# Altium project TrailGuard2.0.PrjPcb
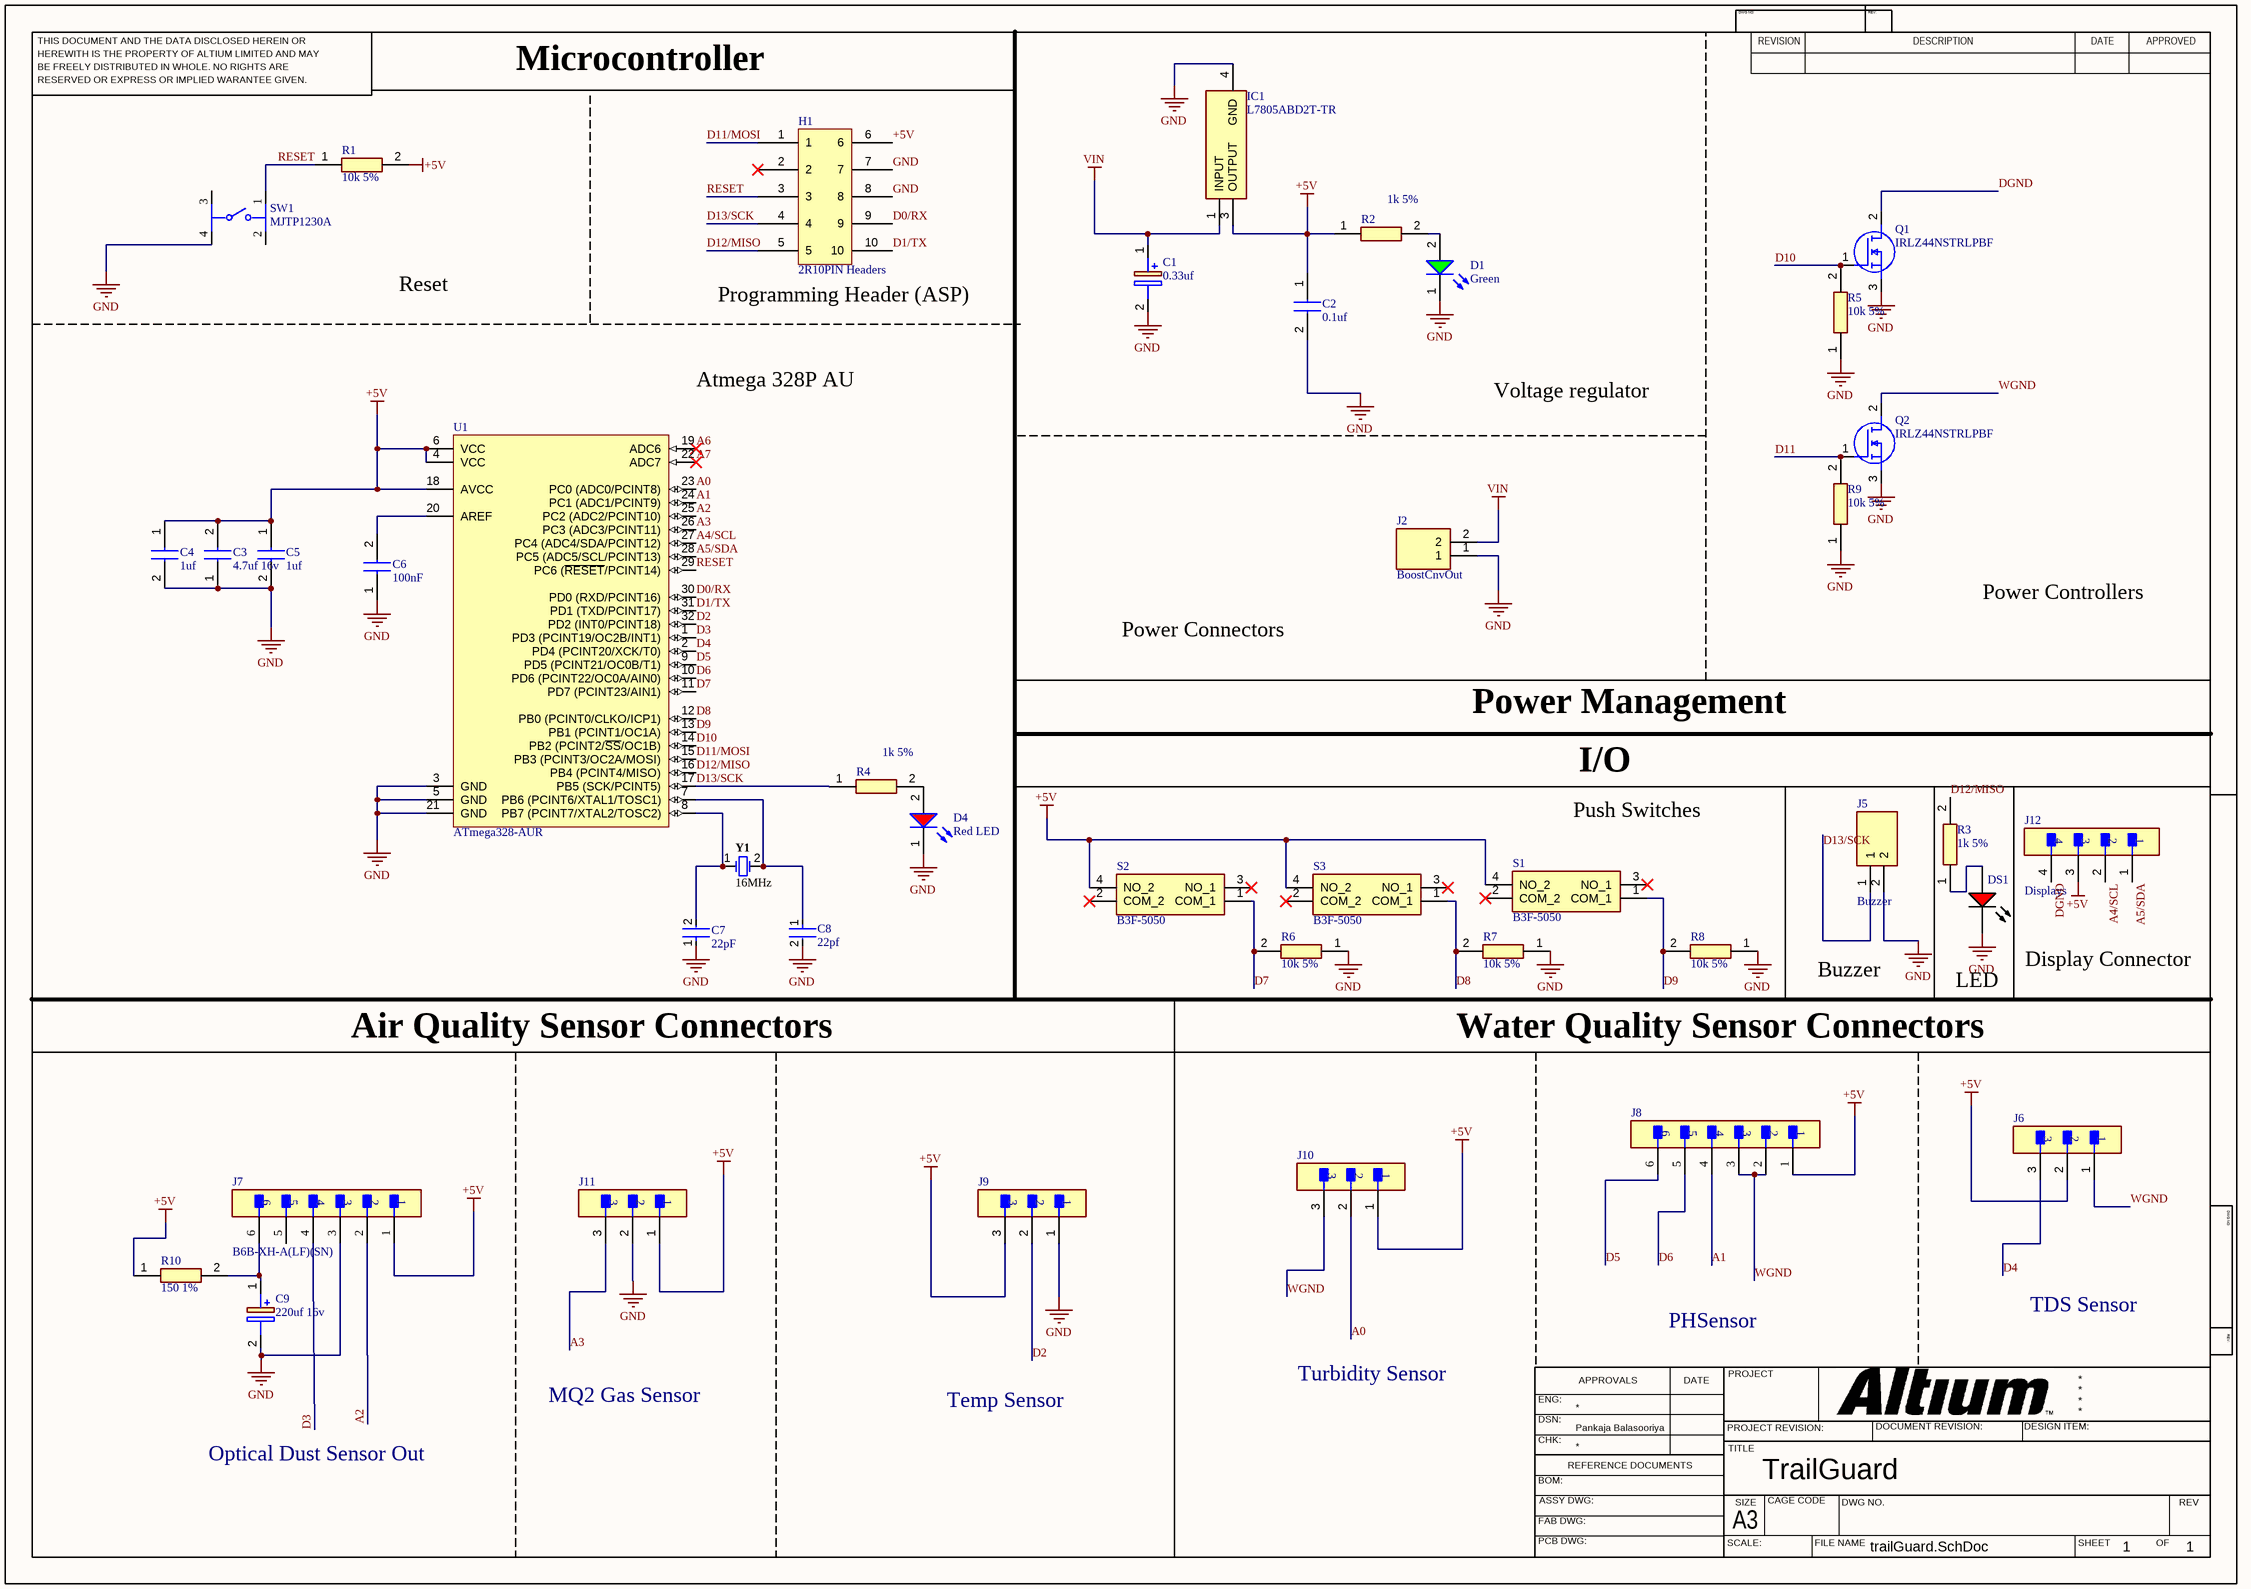
[diagram p0: trailGuard.SchDoc]
1 sheet, 41 parts. Net scope: global (net labels, ports and power ports of the same name join across sheets).
Board file: trailGuard.PcbDoc

## Sheet trailGuard.SchDoc: TrailGuard
size 420 x 297 mm; Author: Pankaja Balasooriya; DrawnBy: Pankaja Balasooriya; SheetNumber: 1; SheetTotal: 1

### Parts
C1  0.33uf  [CAPPM3216X180N]
C2  0.1uf  [C1206]
C3  4.7uf 16v  [CAPC3216X180N]
C4  1uf  [C1206]
C5  1uf  [C1206]
C6  100nF  [CAPC3216X190N]
C7  22pF  [FP-CL21-IPC_C]
C8  22pf  [FP-CL21-IPC_C]
C9  220uf 16v  [EEE0JA331XP]
D1  Green  [WL-SMCW_0805_150080xx75000]
D4  Red LED  [WL-SMCW_0805_150080xx75000]
DS1  HLMP-3301  [AVAG-HLMP-3301-2]  (value not drawn)
H1  2R10PIN Headers  [2R10PIN Headers]
IC1  L7805ABD2T-TR  [D2PAK-STB35NF10T4]
J2  BoostCnvOut  [B2BXHAMLFSN]
J5  Buzzer  [B2BXHAMLFSN]
J6  B3B-XH-A(LF)(SN)  [FP-B3B-XH-A_LF_SN-MFG]  (value not drawn)
J7  B6B-XH-A(LF)(SN)  [FP-B6B-XH-A_LF_SN-MFG]
J8  B6B-XH-A(LF)(SN)  [FP-B6B-XH-A_LF_SN-MFG]  (value not drawn)
J9  B3B-XH-A(LF)(SN)  [FP-B3B-XH-A_LF_SN-MFG]  (value not drawn)
J10  B3B-XH-A(LF)(SN)  [FP-B3B-XH-A_LF_SN-MFG]  (value not drawn)
J11  B3B-XH-A(LF)(SN)  [FP-B3B-XH-A_LF_SN-MFG]  (value not drawn)
J12  Displays  [FP-B4B-XH-AM_LF_SN-MFG]
Q1  IRLZ44NSTRLPBF  [IRF2804STRLPBF]
Q2  IRLZ44NSTRLPBF  [IRF2804STRLPBF]
R1  10k 5%  [RESC3116X70N]
R2  1k 5%  [RESC3116X70N]
R3  1k 5%  [RESC3116X70N]
R4  1k 5%  [RESC3116X70N]
R5  10k 5%  [RESC3116X70N]
R6  10k 5%  [RESC3116X70N]
R7  10k 5%  [RESC3116X70N]
R8  10k 5%  [RESC3116X70N]
R9  10k 5%  [RESC3116X70N]
R10  150 1%  [ERJ8ENF1000V]
S1  B3F-5050  [B3F-4055]
S2  B3F-5050  [B3F-4055]
S3  B3F-5050  [B3F-4055]
SW1  MJTP1230A  [FP-MJTP1230A-MFG]
U1  ATmega328-AUR  [32A_L]
Y1  16MHz  [FOX-FOXSLF160-20]

### Nets
+5V: C2.1 C3.2 C4.1 C5.1 H1.6 IC1.3(OUTPUT) J6.2 J7.1 J8.1 J9.3 J10.1 J11.1 J12.3 R1.2 R2.1 R10.1 S1.4(NO_2) S2.4(NO_2) S3.4(NO_2) U1.4(VCC) U1.6(VCC) U1.18(AVCC)
GND: C1.2(-) C2.2 C3.1 C4.2 C5.2 C6.1 C7.1 C8.2 C9.2(-) D1.1(K) D4.1(K) DS1.1(K) H1.7 H1.8 IC1.4(GND) J2.1 J5.2 J7.3 J9.1 J11.2 Q1.3(S) Q2.3(S) R5.1 R6.1 R7.1 R8.1 R9.1 SW1.4 U1.3(GND) U1.5(GND) U1.21(GND)
VIN: C1.1(+) IC1.1(INPUT) J2.2
A0: J10.2 U1.23(PC0_(ADC0/PCINT8))
A1: J8.4 U1.24(PC1_(ADC1/PCINT9))
A2: J7.2 U1.25(PC2_(ADC2/PCINT10))
A3: J11.3 U1.26(PC3_(ADC3/PCINT11))
A4/SCL: J12.2 U1.27(PC4_(ADC4/SDA/PCINT12))
A5/SDA: J12.1 U1.28(PC5_(ADC5/SCL/PCINT13))
A6: U1.19(ADC6)
A7: U1.22(ADC7)
D0/RX: H1.9 U1.30(PD0_(RXD/PCINT16))
D1/TX: H1.10 U1.31(PD1_(TXD/PCINT17))
D2: J9.2 U1.32(PD2_(INT0/PCINT18))
D3: J7.4 U1.1(PD3_(PCINT19/OC2B/INT1))
D4: J6.3 U1.2(PD4_(PCINT20/XCK/T0))
D5: J8.6 U1.9(PD5_(PCINT21/OC0B/T1))
D6: J8.5 U1.10(PD6_(PCINT22/OC0A/AIN0))
D7: R6.2 S2.1(COM_1) U1.11(PD7_(PCINT23/AIN1))
D8: R7.2 S3.1(COM_1) U1.12(PB0_(PCINT0/CLKO/ICP1))
D9: R8.2 S1.1(COM_1) U1.13(PB1_(PCINT1/OC1A))
D10: Q1.1(G) R5.2 U1.14(PB2_(PCINT2/~{SS}/OC1B))
D11: Q2.1(G) R9.2
D11/MOSI: H1.1 U1.15(PB3_(PCINT3/OC2A/MOSI))
D12/MISO: H1.5 R3.2 U1.16(PB4_(PCINT4/MISO))
D13/SCK: H1.4 J5.1 R4.1 U1.17(PB5_(SCK/PCINT5))
DGND: J12.4 Q1.2(D)
RESET: H1.3 R1.1 SW1.1 U1.29(PC6_(~{RESET}/PCINT14))
WGND: J6.1 J8.2 J8.3 J10.3 Q2.2(D)
NetC6_2: C6.2 U1.20(AREF)
NetC7_2: C7.2 U1.8(PB7_(PCINT7/XTAL2/TOSC2)) Y1.1
NetC8_1: C8.1 U1.7(PB6_(PCINT6/XTAL1/TOSC1)) Y1.2
NetC9_1: C9.1(+) J7.6 R10.2
NetD1_2: D1.2(A) R2.2
NetD4_2: D4.2(A) R4.2
NetDS1_2: DS1.2(A) R3.1

Not connected (* = marked no-connect by the designer): H1 2*; J7 5; S1 2(COM_2)* 3(NO_1)*; S2 2(COM_2)* 3(NO_1)*; S3 2(COM_2)* 3(NO_1)*; SW1 2 3

### Notes on the sheet
- Microcontroller
- Reset
- (near H1) Programming Header (ASP)
- Atmega 328P AU
- Voltage regulator
- Power Connectors
- Power Controllers
- Power Management
- I/O
- Push Switches
- Buzzer
- LED
- Display Connector
- Air Quality Sensor Connectors
- Water Quality Sensor Connectors
- PHSensor
- TDS Sensor
- MQ2 Gas Sensor
- Temp Sensor
- Turbidity Sensor
- Optical Dust Sensor Out
- THIS DOCUMENT AND THE DATA DISCLOSED HEREIN OR
- HEREWITH IS THE PROPERTY OF ALTIUM LIMITED AND MAY
- DWG NO:
- REVISION
- REV:
- DESCRIPTION
- DATE
- APPROVED
- BE FREELY DISTRIBUTED IN WHOLE. NO RIGHTS ARE
- RESERVED OR EXPRESS OR IMPLIED WARANTEE GIVEN.
- ENG:
- APPROVALS
- PROJECT
- DSN:
- CHK:
- REFERENCE DOCUMENTS
- PROJECT REVISION:
- TITLE
- DOCUMENT REVISION:
- DESIGN ITEM:
- BOM:
- FAB DWG:
- PCB DWG:
- ASSY DWG:
- SCALE:
- A3
- SIZE
- CAGE CODE
- FILE NAME
- DWG NO.
- SHEET
- OF
- REV

### Library data of the parts
C1 = 293D334X9035A2TE3: Capacitor Polarised; Manufacturer_Name: Vishay; Datasheet Link: http://www.vishay.com/docs/40002/293d.pdf; Height: 1.8mm; Manufacturer_Part_Number: 293D334X9035A2TE3; Mouser Part Number: 74-293D334X9035A2TE3; Mouser Price/Stock: https://www.mouser.co.uk/ProductDetail/Vishay-Sprague/293D334X9035A2TE3?qs=CH3Q5FKf4qBLTGJb7uLzfw%3D%3D
C2 C4 C5 = C1206C105K5RECTU: Capacitor; Manufacturer_Name: KEMET; Datasheet Link: https://content.kemet.com/datasheets/KEM_C1090_X7R_ESD.pdf; Manufacturer_Part_Number: C1206C105K5RECTU; Mouser Part Number: 80-C1206C105K5RECTU; Mouser Price/Stock: https://www.mouser.co.uk/ProductDetail/KEMET/C1206C105K5RECTU?qs=55YtniHzbhAmzHye57%2FAnw%3D%3D; Arrow Part Number: C1206C105K5RECTU; Arrow Price/Stock: https://www.arrow.com/en/products/c1206c105k5rectu/kemet-corporation
C3 = EMK316B7475KL-T: Capacitor; Manufacturer_Name: TAIYO YUDEN; Datasheet Link: https://componentsearchengine.com/Datasheets/2/EMK316B7475KL-T.pdf; Height: 1.8mm; Manufacturer_Part_Number: EMK316B7475KL-T; Mouser Part Number: 963-EMK316B7475KL-T; Mouser Price/Stock: http://www.mouser.com/Search/ProductDetail.aspx?qs=I6KAKw0tg2xhDY35w16PKg%3d%3d
C6 = MCJCU31LBB7104KTPA01: Capacitor; Manufacturer_Name: TAIYO YUDEN; Datasheet Link: https://ds.yuden.co.jp/TYCOMPAS/ap/specSheet?pn=MCJCU31LBB7104KTPA01; Height: 1.9mm; Manufacturer_Part_Number: MCJCU31LBB7104KTPA01; Mouser Part Number: 963-MCJCU31LBB7104KT; Mouser Price/Stock: https://www.mouser.co.uk/ProductDetail/TAIYO-YUDEN/MCJCU31LBB7104KTPA01?qs=tlsG%2FOw5FFgiqRcQEEePOw%3D%3D
C7 C8 = CMP-13271-000195-1: CL21 Series 0805 22pF 50V ±5% Tolerance C0G Multilayer Ceramic Chip Capacitor; Depth: 1.25mm; Min Operating Temperature: -55°C; Radiation Hardening: No; Length: 2mm; Height: 0.6mm; Capacitance: 22pF; Width: 0.049inch; Voltage Rating: 50V; Mount: Surface Mount; Case Code (Metric): 2012; Max Operating Temperature: 125°C; Dielectric: C0G; Package Quantity: 1; Case Code (Imperial): 0805; Tolerance: 5%; Thickness: 0.028inch; Packaging: Tape and Reel; Ratings: AEC-Q200; Case/Package: 0805
C9 = EEE-FTE221XAP: Capacitor Polarised; Manufacturer_Name: Panasonic; Datasheet Link: http://industrial.panasonic.com/cdbs/www-data/pdf/RDE0000/ABA0000C1240.pdf; Height: 7.8mm; Manufacturer_Part_Number: EEE-FTE221XAP; Mouser Part Number: 667-EEE-FTE221XAP; Mouser Price/Stock: https://www.mouser.co.uk/ProductDetail/Panasonic/EEE-FTE221XAP?qs=CMJjuEs1%252BuHWDEFaun6NQg%3D%3D; Arrow Part Number: EEE-FTE221XAP; Arrow Price/Stock: https://www.arrow.com/en/products/eeefte221xap/panasonic?region=nac
D1 = CMP-1426-00007-2: NexarPartId: 29717780; Wavelength: 520nm; Forward Current: 100mA; Lens Style: Clear, Rectangular; Dominant Wavelength: 525nm; Max Junction Temperature (Tj): 95°C; Power Dissipation: 105mW; Luminous Intensity: 450mcd; Peak Wavelength: 515nm; Viewing Angle: 140°; Test Current: 20mA; Reverse Voltage: 5V; Forward Voltage: 3.2V; Mount: Surface Mount; REACH SVHC: Unknown; Min Operating Temperature: -40°C; Case Code (Imperial): 0805; Case/Package: 0805; Max Operating Temperature: 85°C; RoHS: Compliant; Length: 2mm; Height: 700µm; Width: 1.25mm; Color: Green; Case Code (Metric): 2012; Packaging: Tape and Reel; Max Reverse Voltage (DC): 5V
D4 = CMP-1426-00011-2: NexarPartId: 29717781; Peak Wavelength: 630nm; Wavelength: 625nm; Viewing Angle: 140°; Test Current: 20mA; Forward Voltage: 2V; Forward Current: 100mA; Lens Style: Clear, Rectangular; Luminous Intensity: 150mcd; Max Reverse Voltage (DC): 5V; Length: 2mm; Case Code (Imperial): 0805; RoHS: Compliant; Max Operating Temperature: 85°C; Height: 700µm; Packaging: Tape and Reel; Color: Red; Case/Package: 0805; REACH SVHC: Unknown; Dominant Wavelength: 625nm; Min Operating Temperature: -40°C; Case Code (Metric): 2012; Mount: Surface Mount; Width: 1.25mm
DS1 = CMP-2000-06411-1: T-1 3/4 (5 mm) Diffused LED Lamp, 1.9 V, -40 to 100 degC, 2-Pin THD, RoHS, Bulk; Manufacturer: Avago; Forward Current: 25mA; Forward Voltage: 2.4V; Peak Wavelength: 635nm; Shape Type: Circular; High Brightness: No; Main Category: StandardLED; Test Current (It): 10mA; Dominant Wave Length: 626nm; Number of  Elements: 1; Reverse Voltage: 5V; Chip Material: GaP; Product Height (mm): 9.19mm; Lens Type: ColoredDiffused; Viewing Angle: 60deg; Type: Uni-Color; Emitting Color: Red; Luminous Intensity: 5.4mcd; Power Dissipation: 85W; DELETED: Compliant; Product Depth (mm): 6.1mm; Package Description: 2-Pin Through Hole LED, Dia 5.85 mm; Mounting Technology: ThroughHole; Manufacturer URL: http://www.avagotech.com/; Package Type: T-13/4; Operating Temp Range: -40Cto100C; Datasheet URL: http://www.avagotech.com/docs/AV02-1558EN; Mounting: ThroughHole; Lens Dimensions: 5.08x5.08x8.3mm; Package Reference: HLMP-3301; Datasheet Version: 03/2015; Pin Count: 2; Packaging: TapeandReel; Operating Temperature Classification: Industrial; Lum Intensity: 5.4mcd; Rad Hardened: No; Product Length (mm): 6.1mm
H1 = 2R10PIN Headers: PCB Mount Header, Vertical, Board-to-Board, 10 Position, 2.54 mm [.1 in] Centerline, Breakaway, Tin, Through Hole - Solder, Signal, AMPMODU Headers
IC1 = L7805ABD2T-TR: Integrated Circuit; Manufacturer_Name: STMicroelectronics; Datasheet Link: https://www.st.com/resource/en/datasheet/l78.pdf; Manufacturer_Part_Number: L7805ABD2T-TR; Mouser Part Number: 511-L7805ABD2T-TR; Mouser Price/Stock: https://www.mouser.co.uk/ProductDetail/STMicroelectronics/L7805ABD2T-TR?qs=LL%252BsqOK9SqOQ%2FfZD5ZsNqA%3D%3D; Arrow Part Number: L7805ABD2T-TR; Arrow Price/Stock: https://www.arrow.com/en/products/l7805abd2t-tr/stmicroelectronics?region=nac
J2 J5 = B2B-XH-AM_LF__SN_: Connector; Manufacturer_Name: JST (JAPAN SOLDERLESS TERMINALS); Manufacturer_Part_Number: B2B-XH-AM(LF)(SN); Datasheet Link: https://www.jst-mfg.com/product/pdf/eng/eXH.pdf; Height: 7mm; Arrow Part Number: B2B-XH-AM(LF)(SN); Arrow Price/Stock: https://www.arrow.com/en/products/b2b-xh-am-lf-sn/jst-manufacturing?region=europe
J6 J9-J11 = CMP-17439-000014-3: CONN HEADER VERT 3POS 2.5MM; Max Voltage Rating (DC): 250V; Number of Positions: 3; Current Rating: 3A; Gender: Male; Wire/Cable Gauge: 22AWG; Contact Resistance: 20mR; Insulation Resistance: 1GR; Insulation Material: Nylon; Contact Plating: Tin; Depth: 5.75mm; Contact Type: Male Pin; Max Operating Temperature: 85°C; Insulation Color: Natural; Voltage Rating (AC): 250V; Color: Natural; Connector Type: Header; Orientation: Straight; Fastening Type: Detent; Housing Color: White; Min Operating Temperature: -25°C; Termination: Solder; Voltage Rating: 250V; Series: XH; Pitch: 2.5mm; Contact Shape: Square; Number of Rows: 1; Lead Free: Lead Free; Packaging: Bulk; Mount: Through Hole; Flammability Rating: UL94 V-0; Max Voltage Rating (AC): 250V; REACH SVHC: No SVHC; Housing Material: Polyamide; Contact Material: Brass; Lead Pitch: 2.5mm; Contact Finish - Mating: TIN; Length: 9.9mm; Max Current Rating: 3A; Number of Contacts: 3
J7 J8 = CMP-17439-000076-1: CONN HEADER VERT 6POS 2.5MM
J12 = CMP-17439-000301-1: CONN HEADER VERT 4POS 2.5MM
Q1 Q2 = IRLZ44NSTRLPBF: MOSFET (N-Channel); Manufacturer_Name: Infineon; Datasheet Link: https://www.infineon.com/dgdl/irlz44nspbf.pdf?fileId=5546d462533600a40153567221272727; Height: 4.83mm; Manufacturer_Part_Number: IRLZ44NSTRLPBF; Mouser Part Number: 942-IRLZ44NSTRLPBF; Mouser Price/Stock: https://www.mouser.co.uk/ProductDetail/Infineon-Technologies/IRLZ44NSTRLPBF?qs=9%252BKlkBgLFf1LijFJvUznEg%3D%3D; Arrow Part Number: IRLZ44NSTRLPBF; Arrow Price/Stock: https://www.arrow.com/en/products/irlz44nstrlpbf/infineon-technologies-ag?region=nac
R1 R5-R9 = ERJ-8GEYJ103V: Resistor; Manufacturer_Name: Panasonic; Datasheet Link: https://4donline.ihs.com/images/VipMasterIC/IC/PANA/PANA-S-A0009891627/PANA-S-A0009891627-1.pdf?hkey=52A5661711E402568146F3353EA87419; Height: 0.7mm; Manufacturer_Part_Number: ERJ-8GEYJ103V; Mouser Part Number: 667-ERJ-8GEYJ103V; Mouser Price/Stock: https://www.mouser.co.uk/ProductDetail/Panasonic/ERJ-8GEYJ103V?qs=IZrxGxQQvkNYuW0TYiASIA%3D%3D; Arrow Part Number: ERJ-8GEYJ103V; Arrow Price/Stock: https://www.arrow.com/en/products/erj-8geyj103v/panasonic?region=nac
R2-R4 = ERJ-T08J102V: Resistor; Manufacturer_Name: Panasonic; Datasheet Link: https://datasheet.datasheetarchive.com/originals/distributors/Datasheets_SAMA/36012e4a716ec4a09ea551adc0f8ad50.pdf; Height: 0.7mm; Manufacturer_Part_Number: ERJ-T08J102V; Mouser Part Number: 667-ERJ-T08J102V; Mouser Price/Stock: https://www.mouser.co.uk/ProductDetail/Panasonic/ERJ-T08J102V?qs=iIVTEDlrHA1ZEpy1PD9K4g%3D%3D; Arrow Part Number: ERJ-T08J102V; Arrow Price/Stock: https://www.arrow.com/en/products/erj-t08j102v/panasonic?region=nac
R10 = ERJ-8ENF1500V: Resistor; Manufacturer_Name: Panasonic; Datasheet Link: https://industrial.panasonic.com/cdbs/www-data/pdf/RDA0000/AOA0000C86.pdf; Height: 0.7mm; Manufacturer_Part_Number: ERJ-8ENF1500V; Mouser Part Number: 667-ERJ-8ENF1500V; Mouser Price/Stock: https://www.mouser.co.uk/ProductDetail/Panasonic/ERJ-8ENF1500V?qs=JjxTDIFmKPTW8QBP1YAtHw%3D%3D; Arrow Part Number: ERJ-8ENF1500V; Arrow Price/Stock: https://www.arrow.com/en/products/erj-8enf1500v/panasonic?region=nac
S1-S3 = B3F-5050: Switch; Manufacturer_Name: Omron Electronics; Datasheet Link: https://omronfs.omron.com/en_US/ecb/products/pdf/en-b3f.pdf; Manufacturer_Part_Number: B3F-5050; Mouser Part Number: 653-B3F-5050; Mouser Price/Stock: https://www.mouser.co.uk/ProductDetail/Omron-Electronics/B3F-5050?qs=dOLq8QE0Pqqk%2FO9x2OpTQw%3D%3D; Arrow Part Number: B3F-5050; Arrow Price/Stock: https://www.arrow.com/en/products/b3f5050/omron?region=nac
SW1 = CMP-47024-000004-1: SWITCH TACTILE SPST-NO 0.05A 12V; Mechanical Life: 100000Cycles; Throw Configuration: SPST; Actuator Length: 1.4mm; Switch Travel: 0.25mm; Actuator Color: Black; Operating Force: 160gf; Contact Resistance: 100mR; Actuator Type: Standard; Switch Function: Off-Mom; Actuator Material: Thermoplastic; Illumination Type: Non-Illuminated; Current Rating: 50mA; Min Operating Temperature: -20°C; Series: MJTP; Electrical Life: 100000Cycles; Mount: Through Hole; Packaging: Bulk; Color: Black; Package Quantity: 2000; Voltage Rating (DC): 12V; REACH SVHC: No SVHC; Orientation: Straight; Termination: PC Pin; Contact Material: Bronze; RoHS Compliant: Yes; Max Voltage Rating (DC): 12V; Max Operating Temperature: 70°C; Contact Plating: Silver
U1 = CMP-0095-00268-2: 8-bit AVR Microcontroller, 32KB Flash, 1KB EEPROM, 2KB SRAM, 32-pin TQFP, Industrial Grade (-40°C to 85°C), Reel; PackageDescription: 32-Lead, 7x7x1.0 mm Body, 0.8mm Lead Pitch, Thin Profile Plastic Quad Flat Package (TQFP); ComponentLink1Description: Manufacturer URL; RevisionNote: DatasheetVersion & PackageVersion updated. URLs added.; ComponentLink2URL: http://www.atmel.com/dyn/resources/prod_documents/doc8271.pdf; Code_JEDEC: MS-026-ABA; PackageVersion: revC, Oct-2010; PackageReference: 32A; ComponentLink2Description: ATmega48A/48PA/88A/88PA/168A/168PA/328/328P Datasheet; ComponentLink3Description: ATmega48A/48PA/88A/88PA/168A/168PA/328/328P Summary; ComponentLink1URL: http://www.atmel.com/; DatasheetVersion: revD, May-2011; ComponentLink3URL: http://www.atmel.com/dyn/resources/prod_documents/8271S.pdf
Y1 = CMP-1749-00003-1: Resistance Weld Thru-Hole Crystal, 16 MHz, -20 to 70 degC, 2-Pin THD, RoHS, Bulk; Voltage Rating: 250 V; Tolerance: 1%; Resistance: 221 kohm; Case\Package: Axial; Power Rating: 250 mW; RoHSCompliant: true; Package Quantity: 200; Packaging: Bulk; Min Operating Temperature: -55 degC; DatasheetVersion: Mar-15; ComponentLink1URL: http://www.foxonline.com/; Max Operating Temperature: 155 degC; PackageReference: FOXSLF160-20; Mount: Through Hole; PackageDescription: 2-Pin Through Hole Device, Body 11.35 x 4.65 mm; ComponentLink1Description: Manufacturer URL; ComponentLink2URL: http://www.foxonline.com/pdfs/hc49slf.pdf; ComponentLink2Description: Datasheet; Length: 0.248 inch